# EAGLE schematic p2-001 (EAGLE 9.6.2)
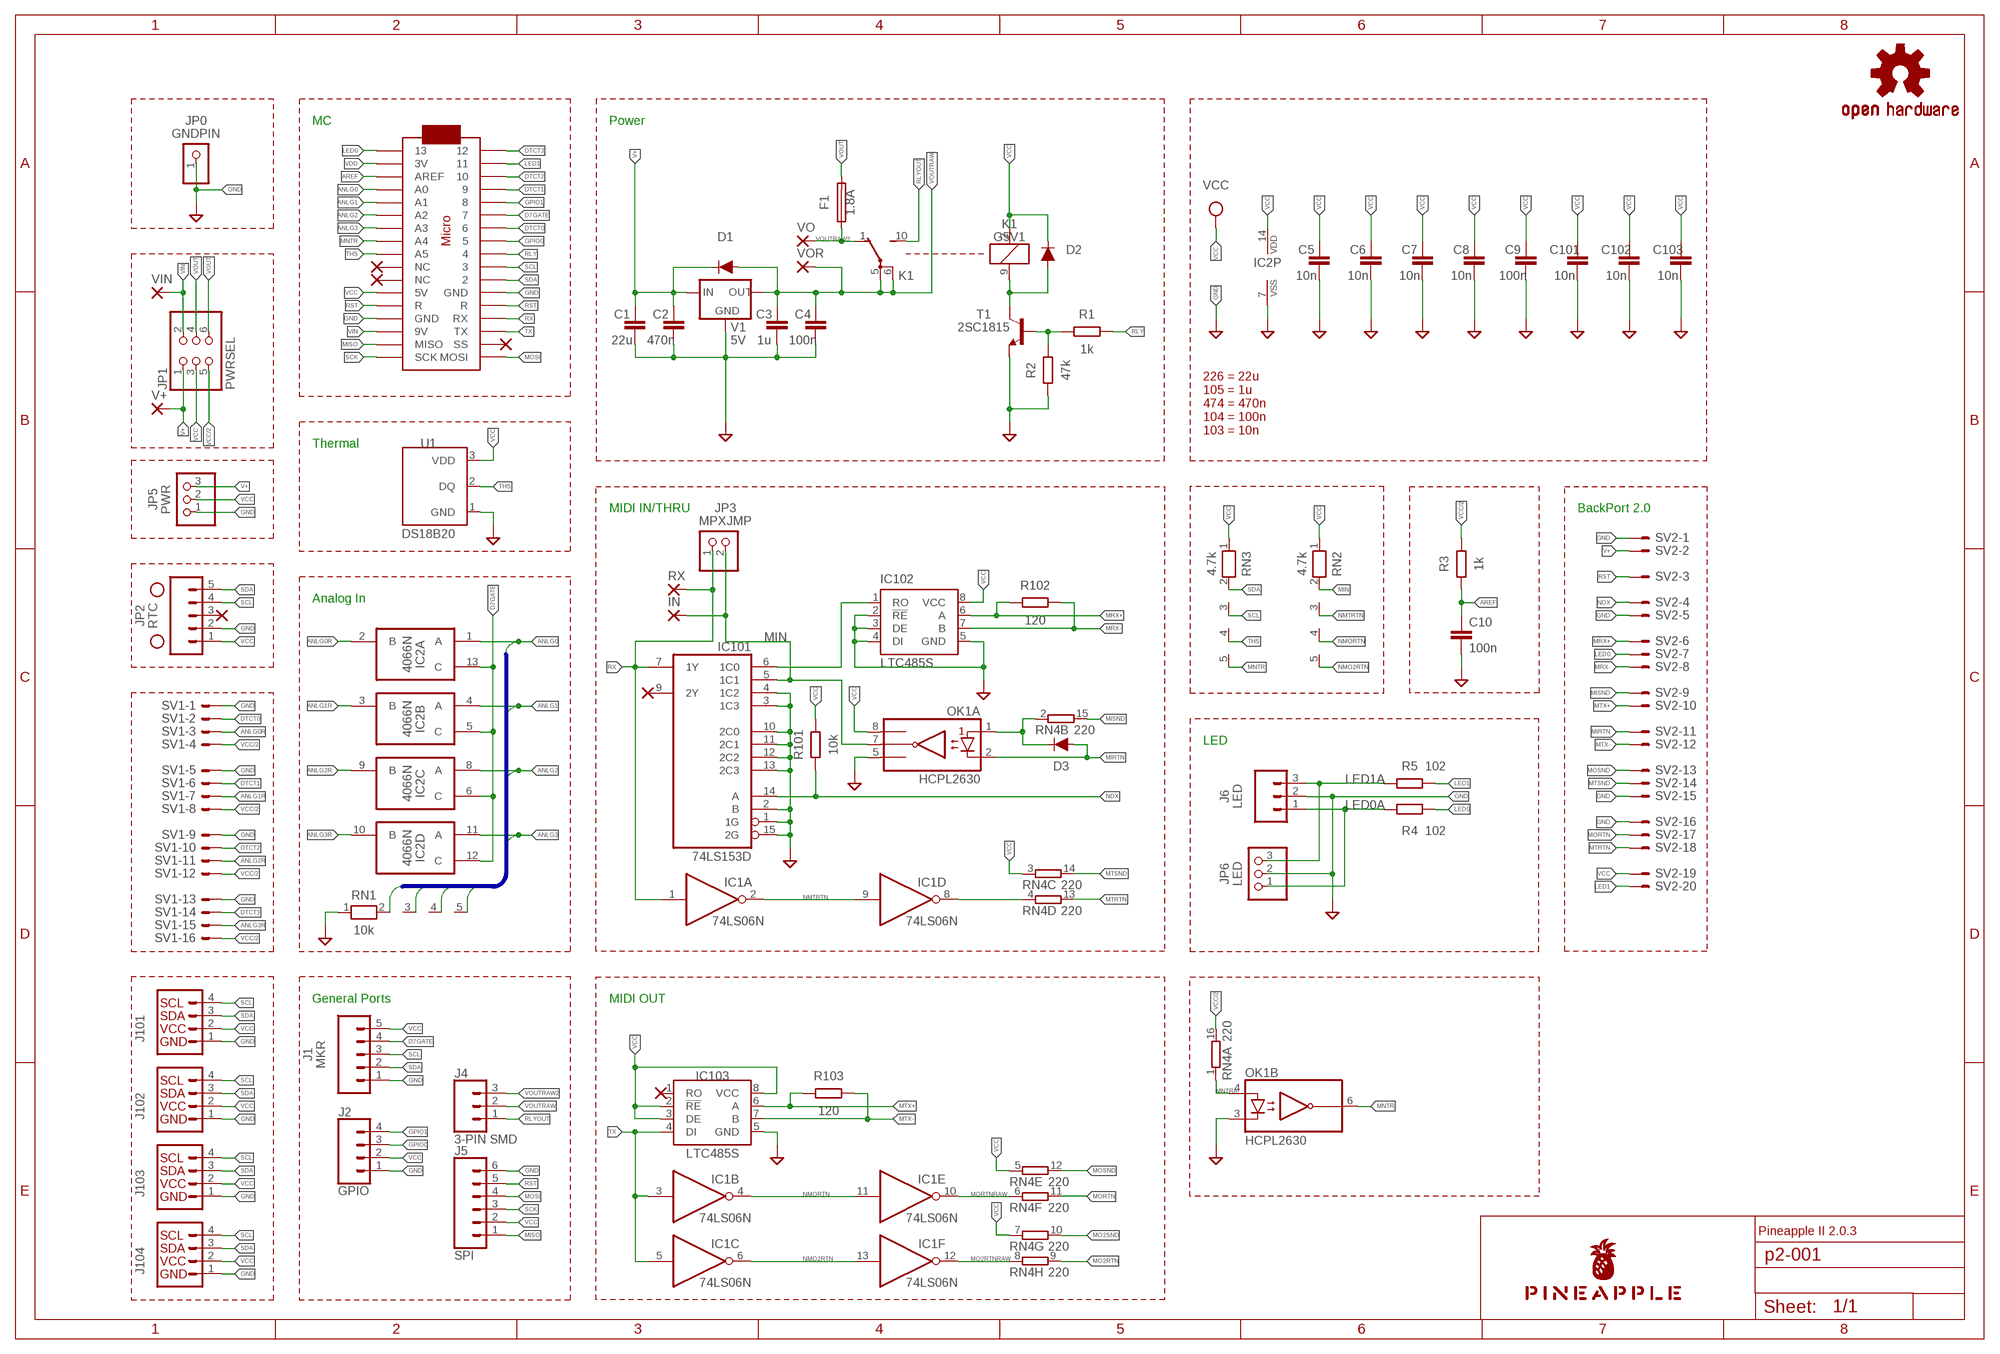
[diagram p0: schematic, sheet 1]

## Parts
C1  22u  C-EU025-050X050  [C025-050X050]
C2  470n  C-EU050-024X044  [C050-024X044]
C3  1u  C-EU050-024X044  [C050-024X044]
C4  100n  C-EU025-024X044  [C025-024X044]
C5  10n  C-EU025-024X044  [C025-024X044]
C6  10n  C-EU025-024X044  [C025-024X044]
C7  10n  C-EU025-024X044  [C025-024X044]
C8  10n  C-EU025-024X044  [C025-024X044]
C9  100n  C-EU025-024X044  [C025-024X044]
C10  100n  C-EU025-024X044  [C025-024X044]
C101  10n  C-EUC2012  [C2012]
C102  10n  C-EUC2012  [C2012]
C103  10n  C-EUC2012  [C2012]
D1  DIODE-1N4148  [DIODE-1N4148]
D2  DIODE-1N4148  [DIODE-1N4148]
D3  DIODE-1N4148  [DIODE-1N4148]
F1  1.8A  TE5  [TE5]
H1  STAND-OFF  [STAND-OFF]
H2  STAND-OFF  [STAND-OFF]
IC1  74LS06N  [DIL14]
IC2  4066N  [DIL14]
IC101  74LS153D  [SO16]
IC102  LTC485S  [SOIC8]
IC103  LTC485S  [SOIC8]
IN  SMD2  [SMD1,27-2,54]
J1  MKR  CONN_05JST  [JST-5-PTH]
J2  GPIO  CONN_04JST-PTH  [JST-4-PTH]
J4  3-PIN SMD  CONN_03JST-SMD  [JST-3-SMD]
J5  SPI  CONN_061.27MM  [1X06_1.27MM]
J6  LED  CONN_03JST-PTH  [JST-3-PTH]
J101  Qwiic  QWIIC_CONNECTORJS-1MM  [1X04_1MM_RA]
J102  Qwiic  QWIIC_CONNECTORJS-1MM  [1X04_1MM_RA]
J103  Qwiic  QWIIC_CONNECTORJS-1MM  [1X04_1MM_RA]
J104  Qwiic  QWIIC_CONNECTORJS-1MM  [1X04_1MM_RA]
JP0  GNDPIN  PINHD-1X1  [1X01]
JP1  PWRSEL  PINHD-2X3  [2X03]
JP2  RTC  CONN_05  [1X05]
JP3  MPXJMP  PINHD-1X2  [1X02]
JP5  PWR  PINHD-1X3  [1X03]
JP6  LED  PINHD-1X3  [1X03]
K1  G5V1  [G5V1]
LOGO1  OSHW-LOGOS-COPPER  [OSHW-LOGO-S_COPPER]
MC1  ARDUINOMICRO  [ARDUINOMICRO]
OK1  HCPL2630  [DIL08]
R1  1k  R-EU_0204/5  [0204/5]
R2  47k  R-EU_0204/5  [0204/5]
R3  1k  R-EU_0204/5  [0204/5]
R4  102  R-EU_0204/5  [0204/5]
R5  102  R-EU_0204/5  [0204/5]
R101  10k  R-EU_M2012  [M2012]
R102  120  R-EU_M2012  [M2012]
R103  120  R-EU_M2012  [M2012]
RN1  10k  RN04  [RN-5]
RN2  4.7k  RN04  [RN-5]
RN3  4.7k  RN04  [RN-5]
RN4  220  8R-N  [DIL16]
RX  SMD2  [SMD1,27-2,54]
SV1  ML16LE  [ML16L]
SV2  ML20LE  [ML20L]
T1  2SC1815  [TO92-ECB]
U1  DS18B20  [TO-92-AMMO]
U$1  PINEAPPLE450_SILK  [PINEAPPLE450_SILK]
V1  5V  78XXL  [78XXL]
V+  SMD2  [SMD1,27-2,54]
VIN  SMD2  [SMD1,27-2,54]
VO  SMD2  [SMD1,27-2,54]
VOR  SMD2  [SMD1,27-2,54]

## Nets
ANLG0 [analog]: IC2.1(A:A) MC1.P$31(A0) RN1.2
ANLG0R [analog]: IC2.2(A:B) SV1.3
ANLG1 [analog]: IC2.4(B:A) MC1.P$30(A1) RN1.3
ANLG1R [analog]: IC2.3(B:B) SV1.7
ANLG2 [analog]: IC2.8(C:A) MC1.P$29(A2) RN1.4
ANLG2R [analog]: IC2.9(C:B) SV1.11
ANLG3 [analog]: IC2.11(D:A) MC1.P$28(A3) RN1.5
ANLG3R [analog]: IC2.10(D:B) SV1.15
AREF: C10.1 MC1.P$32(AREF) R3.1
D7GATE: IC2.5(B:C) IC2.6(C:C) IC2.12(D:C) IC2.13(A:C) J1.4 MC1.P$6
DTCT0: MC1.P$7 SV1.2
DTCT1: MC1.P$4 SV1.6
DTCT2: MC1.P$3 SV1.10
DTCT3: MC1.P$1 SV1.14
GND [gnd]: C1.2 C2.2 C3.2 C4.2 C5.2 C6.2 C7.2 C8.2 C9.2 C10.2 C101.2 C102.2 C103.2 IC2.7(P:VSS) IC101.1(1G) IC101.2(B) IC101.3(1C3) IC101.4(1C2) IC101.10(2C0) IC101.11(2C1) IC101.12(2C2) IC101.13(2C3) IC101.15(2G) IC102.2(!RE) IC102.3(DE) IC102.4(DI) IC102.5(GND) IC103.5(GND) J1.1 J2.1 J5.6 J6.2 J101.1(GND) J102.1(GND) J103.1(GND) J104.1(GND) JP0.1 JP2.2 JP5.1 JP6.2 MC1.P$12(GND) MC1.P$21(GND) OK1.3(B:C2) OK1.5(A:GND) R2.1 RN1.1 SV1.1 SV1.5 SV1.9 SV1.13 SV2.1 SV2.5 SV2.15 SV2.16 T1.E U1.1(GND) V1.GND
GPIO0: J2.3 MC1.P$8
GPIO1: J2.4 MC1.P$5
LED0: MC1.P$34 R4.2 SV2.7
LED0A: J6.1 JP6.1 R4.1
LED1: MC1.P$2 R5.2 SV2.20
LED1A: J6.3 JP6.3 R5.1
MIDIINSND: D3.C OK1.1(A:A1) RN4.2
MIN: IC101.5(1C1) IN.1(P) JP3.2 OK1.7(A:VO1) RN2.2
MIRTN [external]: D3.A OK1.2(A:C1) SV2.11
MISND [external]: RN4.15 SV2.9
MISO: J5.1 MC1.P$19(MISO)
MNTR: MC1.P$27(A4) OK1.6(B:VO2) RN3.5
MNTRA: OK1.4(B:A2) RN4.1
MO2RTN: RN4.9
MO2RTNRAW: IC1.12(F:O) RN4.8
MO2SND: RN4.10
MORTN: RN4.11 SV2.17
MORTNRAW: IC1.10(E:O) RN4.6
MOSI: J5.4 MC1.P$17(MOSI)
MOSND: RN4.12 SV2.13
MRX: IC101.6(1C0) IC102.1(RO)
MRX+: IC102.6(A) R102.1 SV2.6
MRX-: IC102.7(B) R102.2 SV2.8
MTRTN: RN4.13 SV2.18
MTRTNRAW: IC1.8(D:O) RN4.4
MTSND: RN4.14 SV2.14
MTX+: IC103.6(A) R103.1 SV2.10
MTX-: IC103.7(B) R103.2 SV2.12
NDX: IC101.14(A) R101.1 SV2.4
NMO2RTN: IC1.6(C:O) IC1.13(F:I) RN2.5
NMORTN: IC1.4(B:O) IC1.11(E:I) RN2.4
NMTRTN: IC1.2(A:O) IC1.9(D:I) RN2.3
RLY: MC1.P$9 R1.2
RLYDRV: R1.1 R2.2 T1.B
RLYOUT: J4.1 K1.10(2:S)
RLYSNK: D2.A K1.9 T1.C
RST: J5.5 MC1.P$13(R) MC1.P$22(R) SV2.3
RX: IC1.1(A:I) IC101.7(1Y) JP3.1 MC1.P$14(RX) RX.1(P)
SCK: J5.3 MC1.P$18(SCK)
SCL: J1.3 J101.4(SCL) J102.4(SCL) J103.4(SCL) J104.4(SCL) JP2.4 MC1.P$10 RN3.3
SDA: J1.2 J101.3(SDA) J102.3(SDA) J103.3(SDA) J104.3(SDA) JP2.5 MC1.P$11 RN3.2
THS: MC1.P$26(A5) RN3.4 U1.2(DQ)
TX: IC1.3(B:I) IC1.5(C:I) IC103.4(DI) MC1.P$15(TX)
V+ [superpower]: C1.1 C2.1 D1.C JP1.1 JP5.3 SV2.2 V1.IN V+.1(P)
VCC [power]: C5.1 C6.1 C7.1 C8.1 C9.1 C101.1 C102.1 C103.1 D2.C IC2.14(P:VDD) IC102.8(VCC) IC103.2(!RE) IC103.3(DE) IC103.8(VCC) J1.5 J2.2 J5.2 J101.2(VCC) J102.2(VCC) J103.2(VCC) J104.2(VCC) JP1.3 JP2.1 JP5.2 K1.2 MC1.P$23(5V) OK1.8(A:VCC) R101.2 RN2.1 RN3.1 RN4.3 RN4.5 RN4.7 SV2.19 U1.3(VDD)
VCC/2 [superpower]: JP1.5 R3.2 RN4.16 SV1.4 SV1.8 SV1.12 SV1.16
VDD [power]: MC1.P$33(3V)
VIN [superpower]: JP1.2 MC1.P$20(9V) VIN.1(P)
VOUT [superpower]: F1.2 JP1.4 JP1.6
VOUTRAW [superpower]: C3.1 C4.1 D1.A J4.2 K1.5(2:P) K1.6(2:P) V1.OUT VOR.1(P)
VOUTRAW2 [superpower]: F1.1 J4.3 K1.1(2:O) VO.1(P)
Unconnected: IC101.9(2Y) IC103.1(RO) JP2.3 MC1.P$16(SS) MC1.P$24(NC) MC1.P$25(NC)

## Buses
ANLG[0..3]

## Notes on the sheet
- MC | Power
- 226 = 22u
  105 = 1u
  474 = 470n
  104 = 100n
  103 = 10n
- Thermal
- MIDI IN/THRU | BackPort 2.0
- Analog In
- LED
- General Ports | MIDI OUT
- Pineapple II 2.0.3

## Power pins joined to a net without a drawn wire
GND: IC1.7(P:GND) IC101.8(GND)
VCC: IC1.14(P:VCC) IC101.16(VCC)

## Library data of the parts
C1-C4 C9 C10 C101-C103 = rcl:C-EU: CAPACITOR, European symbol; SPICEPREFIX: C
C5-C8 = resistor:C-EU: CAPACITOR, European symbol
D1-D3 = SparkFun-DiscreteSemi:DIODE: Diode These are standard reverse protection diodes and small signal diodes. SparkFun Products: SparkFun SparkPunk Sound Kit <https://www.sparkfun.com/products/11177> SparkFun ESP8266 Thing <https://www.sparkfun.com/products/13231>; PROD_ID: DIO-08378; VALUE: 200mA/100V/1V
F1 = fuse:TE5: FUSE Wickmann; OC_FARNELL: unknown; OC_NEWARK: unknown
H1 H2 = SparkFun-Hardware:STAND-OFF: Stand Off Drill holes for mechanically mounting via screws, standoffs, etc. Note: Use the keepout ring to avoid running the screw head into surrounding components. Variant Overviews STAND-OFF - Mechanical footprint for a #4 phillips button head screw. STAND-OFF-TIGHT - Mechanical footprint for a #4 phillips button head screw, Example SparkFun Products Screw - Phillips Head (1/4", 4-40, 10 pack) <https://www.sparkfun.com/products/10453> (PRT-10453) Screw - Phillips Head (1/2", 4-40, 10 pack) <https://www.sparkfun.com/products/10452> (PRT-10452) Screw - Phillips Head (3/4", 4-40, 10 pack) <https://www.sparkfun.com/products/10451> (PRT-10451) Screw - Phillips Head (1", 4-40, 10 pack) <https://www.sparkfun.com/products/10450> (PRT-10450)
IC1 = 74xx-us:74*06: Hex INVERTER, open collector high-voltage output
IC2 = 40xx:4066: Quad bilateral ANALOG SWITCH
IC101 = 74xx-us:74*153: Dual 4-line to 1-line data SELECTOR/MULTIPLEXER
IC102 IC103 = linear-technology:LTC485: Low Power RS485 Interface Transceiver Source: http://www.linear.com/pc/downloadDocument.do?navId=H0,C1,C1007,C1017,P2064,D1718; OC_FARNELL: unknown; OC_NEWARK: unknown
IN RX V+ VIN VO VOR = wirepad:SMD2: SMD PAD
J1 = SparkFun-Connectors:CONN_05: Multi connection point. Often used as Generic Header-pin footprint for 0.1 inch spaced/style header connections On any of the 0.1 inch spaced packages, you can populate with these: Break Away Headers - Straight <https://www.sparkfun.com/products/116> (PRT-00116) Break Away Male Headers - Right Angle <https://www.sparkfun.com/products/553> (PRT-00553) Female Headers <https://www.sparkfun.com/products/115> (PRT-00115) Break Away Headers - Machine Pin <https://www.sparkfun.com/products/117> (PRT-00117) Break Away Female Headers - Swiss Machine Pin <https://www.sparkfun.com/products/743> (PRT-00743) For SCREWTERMINALS and SPRING TERMINALS visit here: Screw Terimnals on SparkFun.com <https://www.sparkfun.com/search/results?term=Screw+Terminals> (5mm/3.5mm/2.54mm spacing) This device is also useful as a general connection point to wire up your design to another part of your project. Our various solder wires solder well into these plated through hole pads. Hook-Up Wire - Assortment (Stranded, 22 AWG) <https://www.sparkfun.com/products/11375> (PRT-11375) Hook-Up Wire - Assortment (Solid Core, 22 AWG) <https://www.sparkfun.com/products/11367> (PRT-11367) View the entire wire category on our website here <https://www.sparkfun.com/categories/141> Special notes: Molex polarized connector foot print use with SKU : PRT-08231 with associated crimp pins and housings. 1MM SMD Version SKU: PRT-10208; SF_ID: PRT-09917
J2 = SparkFun-Connectors:CONN_04: Multi connection point. Often used as Generic Header-pin footprint for 0.1 inch spaced/style header connections On any of the 0.1 inch spaced packages, you can populate with these: Break Away Headers - Straight <https://www.sparkfun.com/products/116> (PRT-00116) Break Away Male Headers - Right Angle <https://www.sparkfun.com/products/553> (PRT-00553) Female Headers <https://www.sparkfun.com/products/115> (PRT-00115) Break Away Headers - Machine Pin <https://www.sparkfun.com/products/117> (PRT-00117) Break Away Female Headers - Swiss Machine Pin <https://www.sparkfun.com/products/743> (PRT-00743) For SCREWTERMINALS and SPRING TERMINALS visit here: Screw Terimnals on SparkFun.com <https://www.sparkfun.com/search/results?term=Screw+Terminals> (5mm/3.5mm/2.54mm spacing) This device is also useful as a general connection point to wire up your design to another part of your project. Our various solder wires solder well into these plated through hole pads. Hook-Up Wire - Assortment (Stranded, 22 AWG) <https://www.sparkfun.com/products/11375> (PRT-11375) Hook-Up Wire - Assortment (Solid Core, 22 AWG) <https://www.sparkfun.com/products/11367> (PRT-11367) View the entire wire category on our website here <https://www.sparkfun.com/categories/141> Special notes: Molex polarized connector foot print use with SKU : PRT-08231 with associated crimp pins and housings. 1MM SMD Version SKU: PRT-10208; PROD_ID: WIRE-13531; SF_ID: PRT-09916
J4 = SparkFun-Connectors:CONN_03: Multi connection point. Often used as Generic Header-pin footprint for 0.1 inch spaced/style header connections On any of the 0.1 inch spaced packages, you can populate with these: Break Away Headers - Straight <https://www.sparkfun.com/products/116> (PRT-00116) Break Away Male Headers - Right Angle <https://www.sparkfun.com/products/553> (PRT-00553) Female Headers <https://www.sparkfun.com/products/115> (PRT-00115) Break Away Headers - Machine Pin <https://www.sparkfun.com/products/117> (PRT-00117) Break Away Female Headers - Swiss Machine Pin <https://www.sparkfun.com/products/743> (PRT-00743) Stackable Header - 3 Pin (Female, 0.1") <https://www.sparkfun.com/products/13875> (PRT-13875) For SCREWTERMINALS and SPRING TERMINALS visit here: Screw Terimnals on SparkFun.com <https://www.sparkfun.com/search/results?term=Screw+Terminals> (5mm/3.5mm/2.54mm spacing) This device is also useful as a general connection point to wire up your design to another part of your project. Our various solder wires solder well into these plated through hole pads. Hook-Up Wire - Assortment (Stranded, 22 AWG) <https://www.sparkfun.com/products/11375> (PRT-11375) Hook-Up Wire - Assortment (Solid Core, 22 AWG) <https://www.sparkfun.com/products/11367> (PRT-11367) View the entire wire category on our website here <https://www.sparkfun.com/categories/141> Special notes: Molex polarized connector foot print use with SKU : PRT-08232 with associated crimp pins and housings.; PROD_ID: CONN-12591
J5 = SparkFun-Connectors:CONN_06: Multi connection point. Often used as Generic Header-pin footprint for 0.1 inch spaced/style header connections On any of the 0.1 inch spaced packages, you can populate with these: Break Away Headers - Straight <https://www.sparkfun.com/products/116> (PRT-00116) Break Away Male Headers - Right Angle <https://www.sparkfun.com/products/553> (PRT-00553) Female Headers <https://www.sparkfun.com/products/115> (PRT-00115) Break Away Headers - Machine Pin <https://www.sparkfun.com/products/117> (PRT-00117) Break Away Female Headers - Swiss Machine Pin <https://www.sparkfun.com/products/743> (PRT-00743) Arduino Stackable Header - 6 Pin <https://www.sparkfun.com/products/9280> (PRT-09280) For SCREWTERMINALS and SPRING TERMINALS visit here: Screw Terimnals on SparkFun.com <https://www.sparkfun.com/search/results?term=Screw+Terminals> (5mm/3.5mm/2.54mm spacing) This device is also useful as a general connection point to wire up your design to another part of your project. Our various solder wires solder well into these plated through hole pads. Hook-Up Wire - Assortment (Stranded, 22 AWG) <https://www.sparkfun.com/products/11375> (PRT-11375) Hook-Up Wire - Assortment (Solid Core, 22 AWG) <https://www.sparkfun.com/products/11367> (PRT-11367) View the entire wire category on our website here <https://www.sparkfun.com/categories/141>
J6 = SparkFun-Connectors:CONN_03: Multi connection point. Often used as Generic Header-pin footprint for 0.1 inch spaced/style header connections On any of the 0.1 inch spaced packages, you can populate with these: Break Away Headers - Straight <https://www.sparkfun.com/products/116> (PRT-00116) Break Away Male Headers - Right Angle <https://www.sparkfun.com/products/553> (PRT-00553) Female Headers <https://www.sparkfun.com/products/115> (PRT-00115) Break Away Headers - Machine Pin <https://www.sparkfun.com/products/117> (PRT-00117) Break Away Female Headers - Swiss Machine Pin <https://www.sparkfun.com/products/743> (PRT-00743) Stackable Header - 3 Pin (Female, 0.1") <https://www.sparkfun.com/products/13875> (PRT-13875) For SCREWTERMINALS and SPRING TERMINALS visit here: Screw Terimnals on SparkFun.com <https://www.sparkfun.com/search/results?term=Screw+Terminals> (5mm/3.5mm/2.54mm spacing) This device is also useful as a general connection point to wire up your design to another part of your project. Our various solder wires solder well into these plated through hole pads. Hook-Up Wire - Assortment (Stranded, 22 AWG) <https://www.sparkfun.com/products/11375> (PRT-11375) Hook-Up Wire - Assortment (Solid Core, 22 AWG) <https://www.sparkfun.com/products/11367> (PRT-11367) View the entire wire category on our website here <https://www.sparkfun.com/categories/141> Special notes: Molex polarized connector foot print use with SKU : PRT-08232 with associated crimp pins and housings.; PROD_ID: WIRE-10037; SF_ID: PRT-09915
J101-J104 = SparkFun-Connectors:QWIIC_CONNECTOR: SparkFun I2C Standard Qwiic Connector An SMD 1mm pitch JST connector makes it easy and quick (get it? Qwiic?) to connect I2C devices to each other. The Qwiic system <http://www.sparkfun.com/qwiic> enables fast and solderless connection between popular platforms and various sensors and actuators. We carry 200mm <https://www.sparkfun.com/products/14204>, 100mm <https://www.sparkfun.com/products/14205>, 50mm <https://www.sparkfun.com/products/14206>, and breadboard friendly <https://www.sparkfun.com/products/14207> Qwiic cables. We also offer 10 pcs strips <https://www.sparkfun.com/products/14323> the SMD connectors.
JP0 = pinhead:PINHD-1X1: PIN HEADER
JP1 = pinhead:PINHD-2X3: PIN HEADER
JP2 = SparkFun-Connectors:CONN_05: Multi connection point. Often used as Generic Header-pin footprint for 0.1 inch spaced/style header connections On any of the 0.1 inch spaced packages, you can populate with these: Break Away Headers - Straight <https://www.sparkfun.com/products/116> (PRT-00116) Break Away Male Headers - Right Angle <https://www.sparkfun.com/products/553> (PRT-00553) Female Headers <https://www.sparkfun.com/products/115> (PRT-00115) Break Away Headers - Machine Pin <https://www.sparkfun.com/products/117> (PRT-00117) Break Away Female Headers - Swiss Machine Pin <https://www.sparkfun.com/products/743> (PRT-00743) For SCREWTERMINALS and SPRING TERMINALS visit here: Screw Terimnals on SparkFun.com <https://www.sparkfun.com/search/results?term=Screw+Terminals> (5mm/3.5mm/2.54mm spacing) This device is also useful as a general connection point to wire up your design to another part of your project. Our various solder wires solder well into these plated through hole pads. Hook-Up Wire - Assortment (Stranded, 22 AWG) <https://www.sparkfun.com/products/11375> (PRT-11375) Hook-Up Wire - Assortment (Solid Core, 22 AWG) <https://www.sparkfun.com/products/11367> (PRT-11367) View the entire wire category on our website here <https://www.sparkfun.com/categories/141> Special notes: Molex polarized connector foot print use with SKU : PRT-08231 with associated crimp pins and housings. 1MM SMD Version SKU: PRT-10208
JP3 = pinhead:PINHD-1X2: PIN HEADER
JP5 JP6 = pinhead:PINHD-1X3: PIN HEADER
K1 = relay:G5V1: RELAY 1 x switch, 0.5 A/125 V AC, 1 A/24 V DC , Omron; MPN: G5V-1-DC24; OC_FARNELL: 9949593; OC_NEWARK: 36M6377
LOGO1 = SparkFun-Aesthetics:OSHW-LOGO: Open-Source Hardware (OSHW) Logo This logo indicates the piece of hardware it is found on incorporates a OSHW license and/or adheres to the definition of open source hardware found here: http://freedomdefined.org/OSHW
MC1 = adafruit:ARDUINOMICRO
OK1 = optocoupler:HCPL2630: HEWLETT PACKARD OPTO COUPLER; MF: AGILENT TECHNOLOGIES; MPN: HCPL-2630-000E; OC_FARNELL: 9994904; OC_NEWARK: 88H7813
R1-R5 = resistor:R-EU_: RESISTOR, European symbol
R101-R103 = rcl:R-EU_: RESISTOR, European symbol; SPICEPREFIX: R
RN1-RN3 = resistor-net:RN04: RESISTOR NETWORK; OC_FARNELL: unknown; OC_NEWARK: unknown
RN4 = resistor-dil:8R-N: DIL RESISTOR; OC_FARNELL: unknown; OC_NEWARK: unknown
SV1 = con-ml:ML16LE: HARTING; OC_FARNELL: unknown; OC_NEWARK: unknown
SV2 = con-ml:ML20LE: HARTING; OC_FARNELL: unknown; OC_NEWARK: unknown
T1 = transistor:2SC1815: NPN EPITAXIAL TRANSISTOR Source: TOSHIBA .. 2SC1815 1.pdf
U1 = SparkFun-Sensors:DS18B20: Dallas/Maxim DS18B20 1-Wire Temperature Sensor The DS18B20 reports degrees C with 9 to 12-bit precision, -55C to 125C (+/-0.5C). Each sensor has a unique 64-Bit Serial number etched into it - allows for a huge number of sensors to be used on one data bus. Datasheet <http://datasheets.maximintegrated.com/en/ds/DS18B20.pdf> SparkFun Products One Wire Digital Temperature Sensor - DS18B20 <https://www.sparkfun.com/products/245> (SEN-00245); STORE_ID: SEN-00245
U$1 = pineapple:PINEAPPLE450_SILK
V1 = v-reg:78XXL: VOLTAGE REGULATOR

## Net classes
0 default: width 0.152 mm, drill 0.152 mm, clearance 0.152 mm
1 gnd: width 0.305 mm, drill 0.152 mm, clearance 0.152 mm
2 power: width 0.508 mm, drill 0.152 mm, clearance 0.152 mm
3 analog: width 0.305 mm, drill 0.152 mm, clearance 0.152 mm
4 external: width 0.152 mm, drill 0.152 mm, clearance 0.152 mm
5 superpower: width 1.016 mm, drill 0.152 mm, clearance 0.152 mm